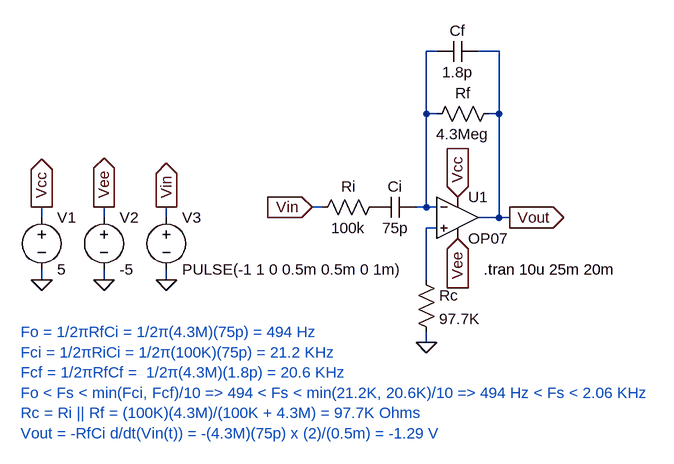
[diagram p0: schematic op-amp_differentiating_amplifier.asc]
op-amp_differentiating_amplifier.asc, the LTspice schematic file:
Version 4
SHEET 1 880 828
WIRE 416 64 400 64
WIRE 512 64 480 64
WIRE 400 160 400 64
WIRE 416 160 400 160
WIRE 512 160 512 64
WIRE 512 160 496 160
WIRE 240 304 224 304
WIRE 400 304 400 160
WIRE 400 304 384 304
WIRE 416 304 400 304
WIRE -192 320 -192 304
WIRE -96 320 -96 304
WIRE 0 320 0 304
WIRE 512 320 512 160
WIRE 512 320 480 320
WIRE 528 320 512 320
WIRE 416 336 400 336
WIRE -192 416 -192 400
WIRE -96 416 -96 400
WIRE 0 416 0 400
WIRE 400 416 400 336
WIRE 400 512 400 496
FLAG 448 288 Vcc
IOPIN 448 288 In
FLAG 448 352 Vee
IOPIN 448 352 In
FLAG 224 304 Vin
IOPIN 224 304 In
FLAG 528 320 Vout
IOPIN 528 320 Out
FLAG -192 416 0
FLAG -96 416 0
FLAG 0 416 0
FLAG -192 304 Vcc
IOPIN -192 304 Out
FLAG -96 304 Vee
IOPIN -96 304 Out
FLAG 0 304 Vin
IOPIN 0 304 Out
FLAG 400 512 0
SYMBOL OpAmps/OP07 448 256 R0
SYMATTR InstName U1
SYMBOL res 512 144 R90
WINDOW 0 0 56 VBottom 2
WINDOW 3 32 56 VTop 2
SYMATTR InstName Rf
SYMATTR Value 4.3Meg
SYMBOL voltage -192 304 R0
SYMATTR InstName V1
SYMATTR Value 5
SYMBOL voltage -96 304 R0
SYMATTR InstName V2
SYMATTR Value -5
SYMBOL voltage 0 304 R0
SYMATTR InstName V3
SYMATTR Value PULSE(-1 1 0 0.5m 0.5m 0 1m)
SYMBOL res 336 288 R90
WINDOW 0 0 56 VBottom 2
WINDOW 3 32 56 VTop 2
SYMATTR InstName Ri
SYMATTR Value 100k
SYMBOL cap 480 48 R90
WINDOW 0 0 32 VBottom 2
WINDOW 3 32 32 VTop 2
SYMATTR InstName Cf
SYMATTR Value 1.8p
SYMBOL cap 384 288 R90
WINDOW 0 0 32 VBottom 2
WINDOW 3 32 32 VTop 2
SYMATTR InstName Ci
SYMATTR Value 75p
SYMBOL res 384 400 R0
SYMATTR InstName Rc
SYMATTR Value 97.7K
TEXT 488 400 Left 2 !.tran 10u 25m 20m
TEXT -224 496 Left 2 ;Fo = 1/2πRfCi = 1/2π(4.3M)(75p) = 494 Hz\nFci = 1/2πRiCi = 1/2π(100K)(75p) = 21.2 KHz\nFcf = 1/2πRfCf =  1/2π(4.3M)(1.8p) = 20.6 KHz\nFo < Fs < min(Fci, Fcf)/10 => 494 < Fs < min(21.2K, 20.6K)/10 => 494 Hz < Fs < 2.06 KHz\nRc = Ri || Rf = (100K)(4.3M)/(100K + 4.3M) = 97.7K Ohms\nVout = -RfCi d/dt(Vin(t)) = -(4.3M)(75p) x (2)/(0.5m) = -1.29 V

The netlist it stands for:
* op-amp_differentiating_amplifier.asc
XU1 N002 N001 Vcc Vee Vout LT1001  ; OP07, pins In+ In- V+ V- OUT
Rf Vout N001 4.3Meg
V1 Vcc 0 5
V2 Vee 0 -5
V3 Vin 0 PULSE(-1 1 0 0.5m 0.5m 0 1m)
Ri P001 Vin 100k
Cf Vout N001 1.8p
Ci N001 P001 75p
Rc N002 0 97.7K
.tran 10u 25m 20m
* Fo = 1/2πRfCi = 1/2π(4.3M)(75p) = 494 Hz
* Fci = 1/2πRiCi = 1/2π(100K)(75p) = 21.2 KHz
* Fcf = 1/2πRfCf =  1/2π(4.3M)(1.8p) = 20.6 KHz
* Fo < Fs < min(Fci, Fcf)/10 => 494 < Fs < min(21.2K, 20.6K)/10 => 494 Hz < Fs < 2.06 KHz
* Rc = Ri || Rf = (100K)(4.3M)/(100K + 4.3M) = 97.7K Ohms
* Vout = -RfCi d/dt(Vin(t)) = -(4.3M)(75p) x (2)/(0.5m) = -1.29 V
.lib LTC.lib
.backanno
.end